# Altium schematic sheet Avalon_ctrlunit.SchDoc
size A1
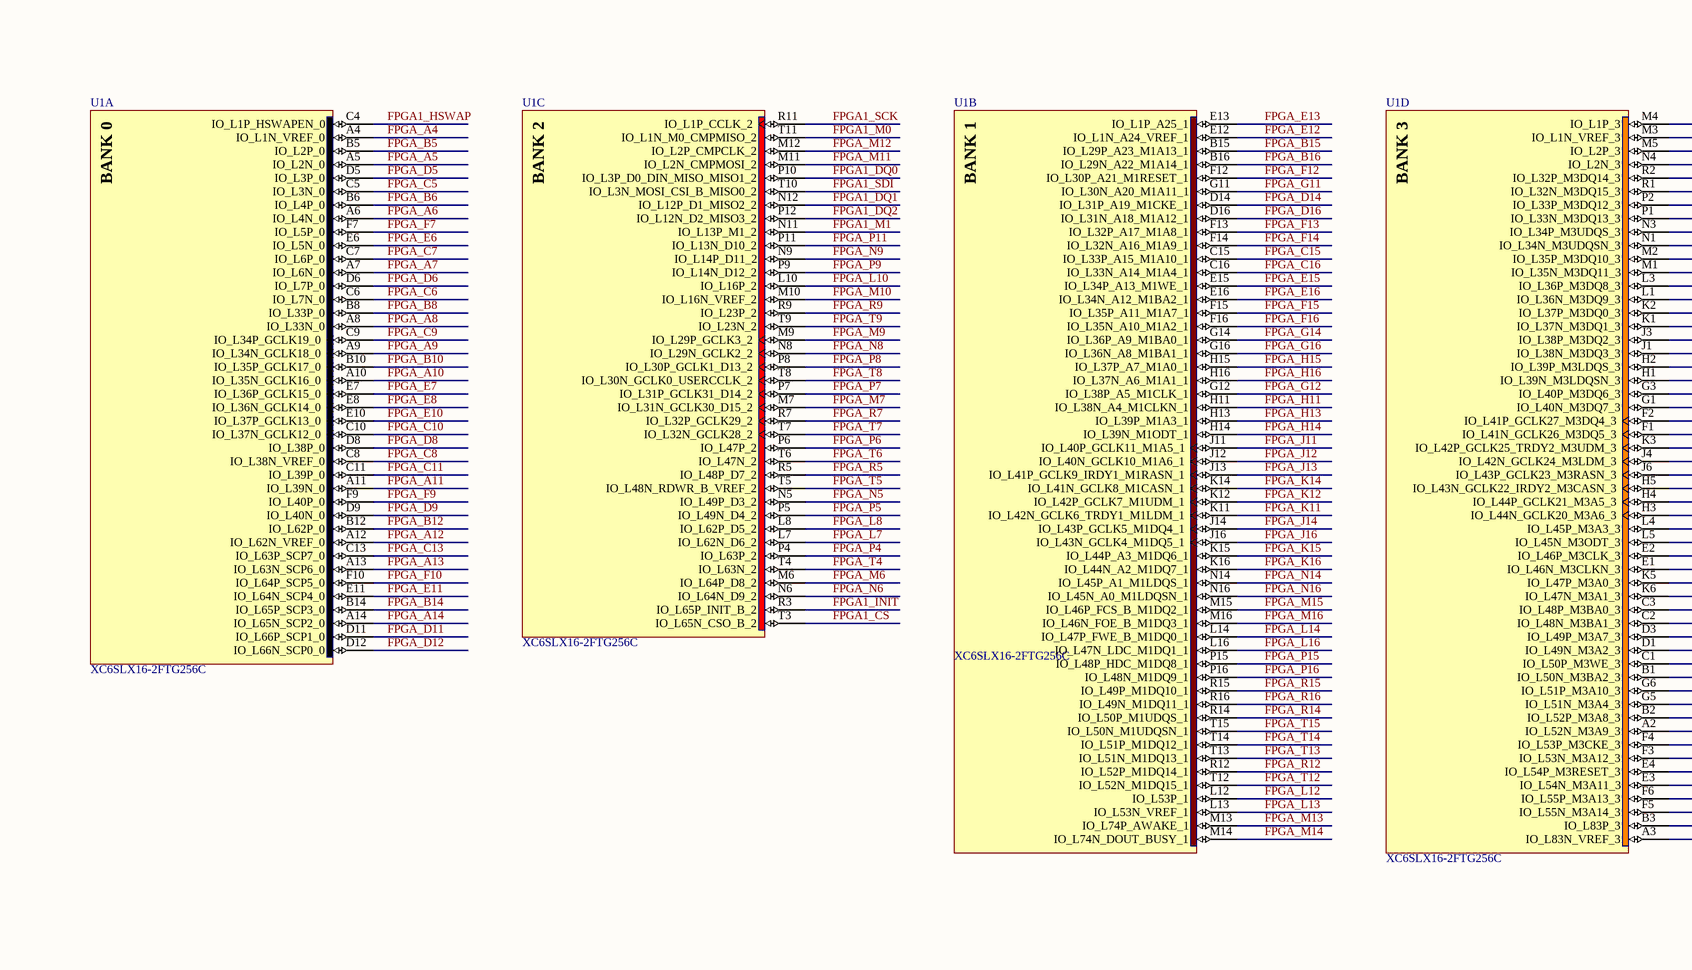
[diagram p0: Avalon_ctrlunit.SchDoc, top left]
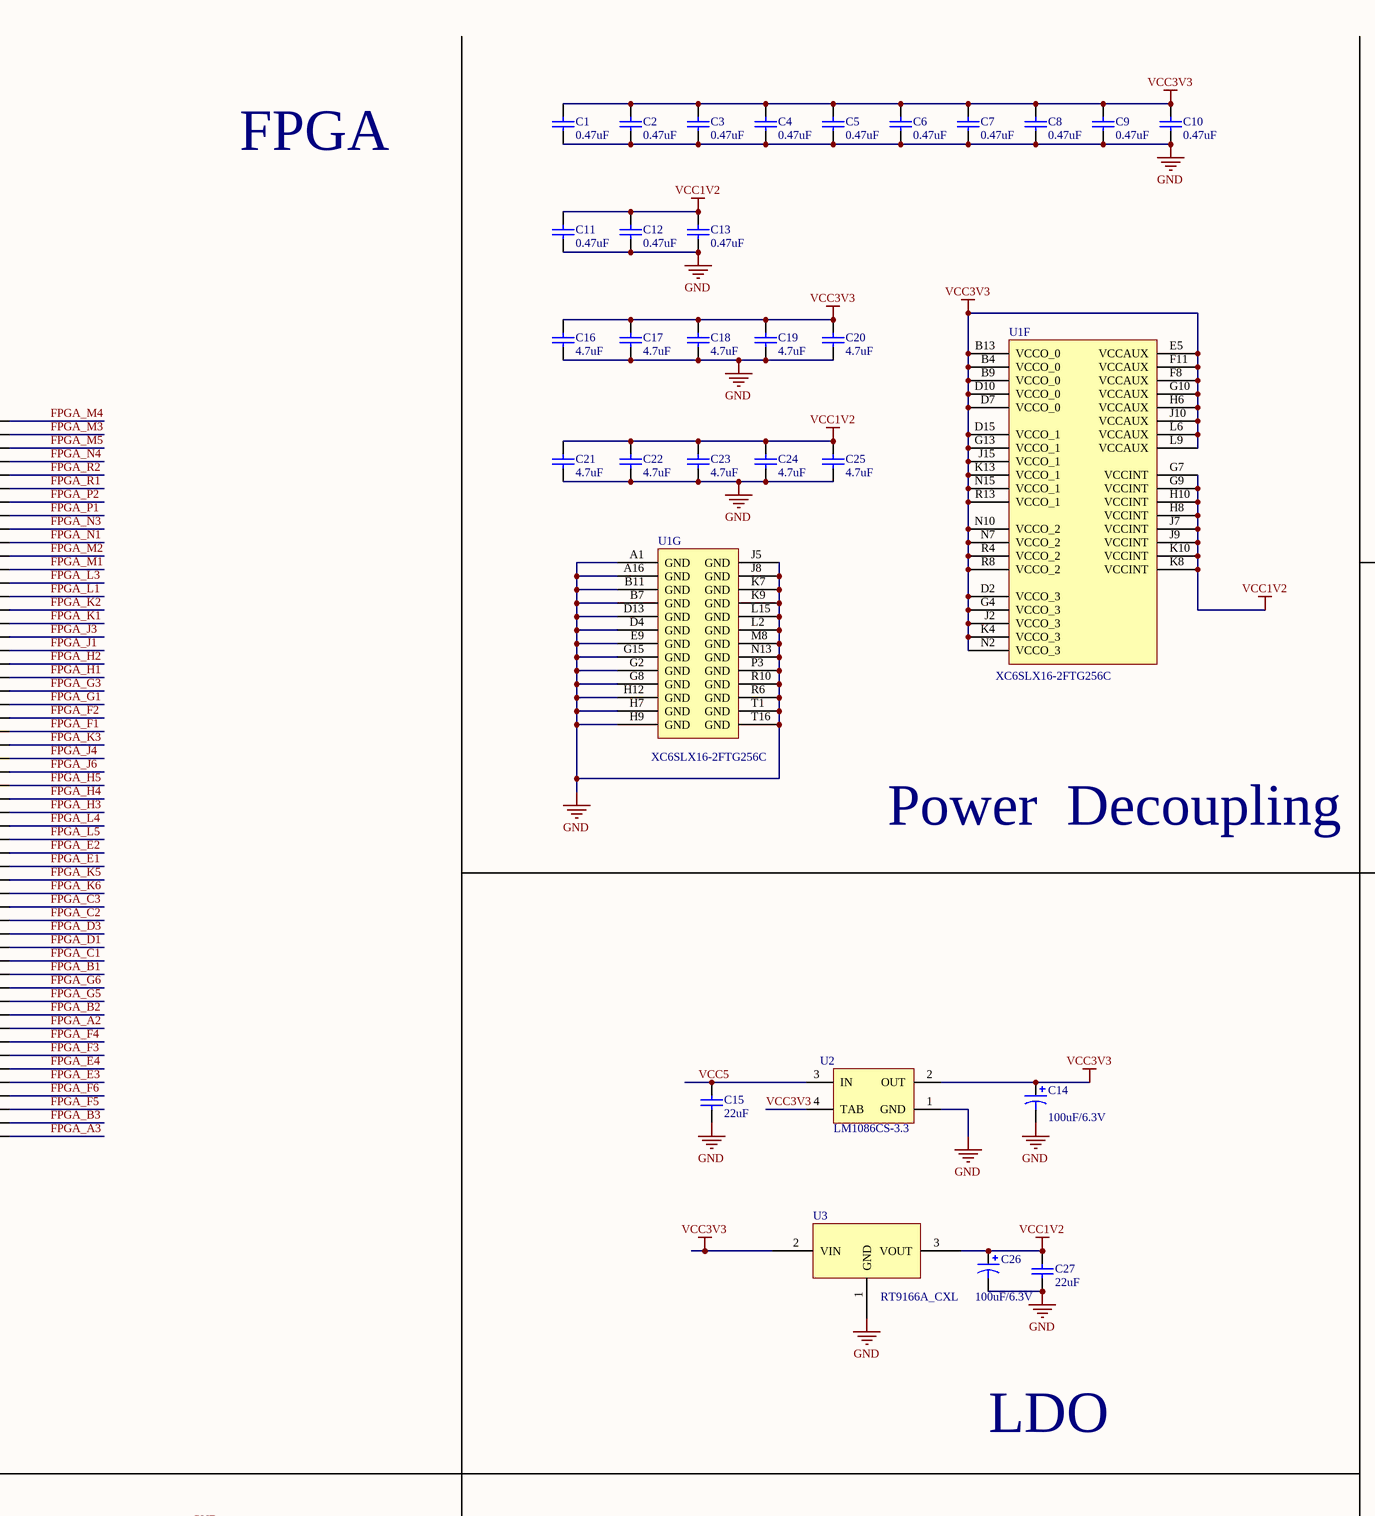
[diagram p1: Avalon_ctrlunit.SchDoc, top middle]
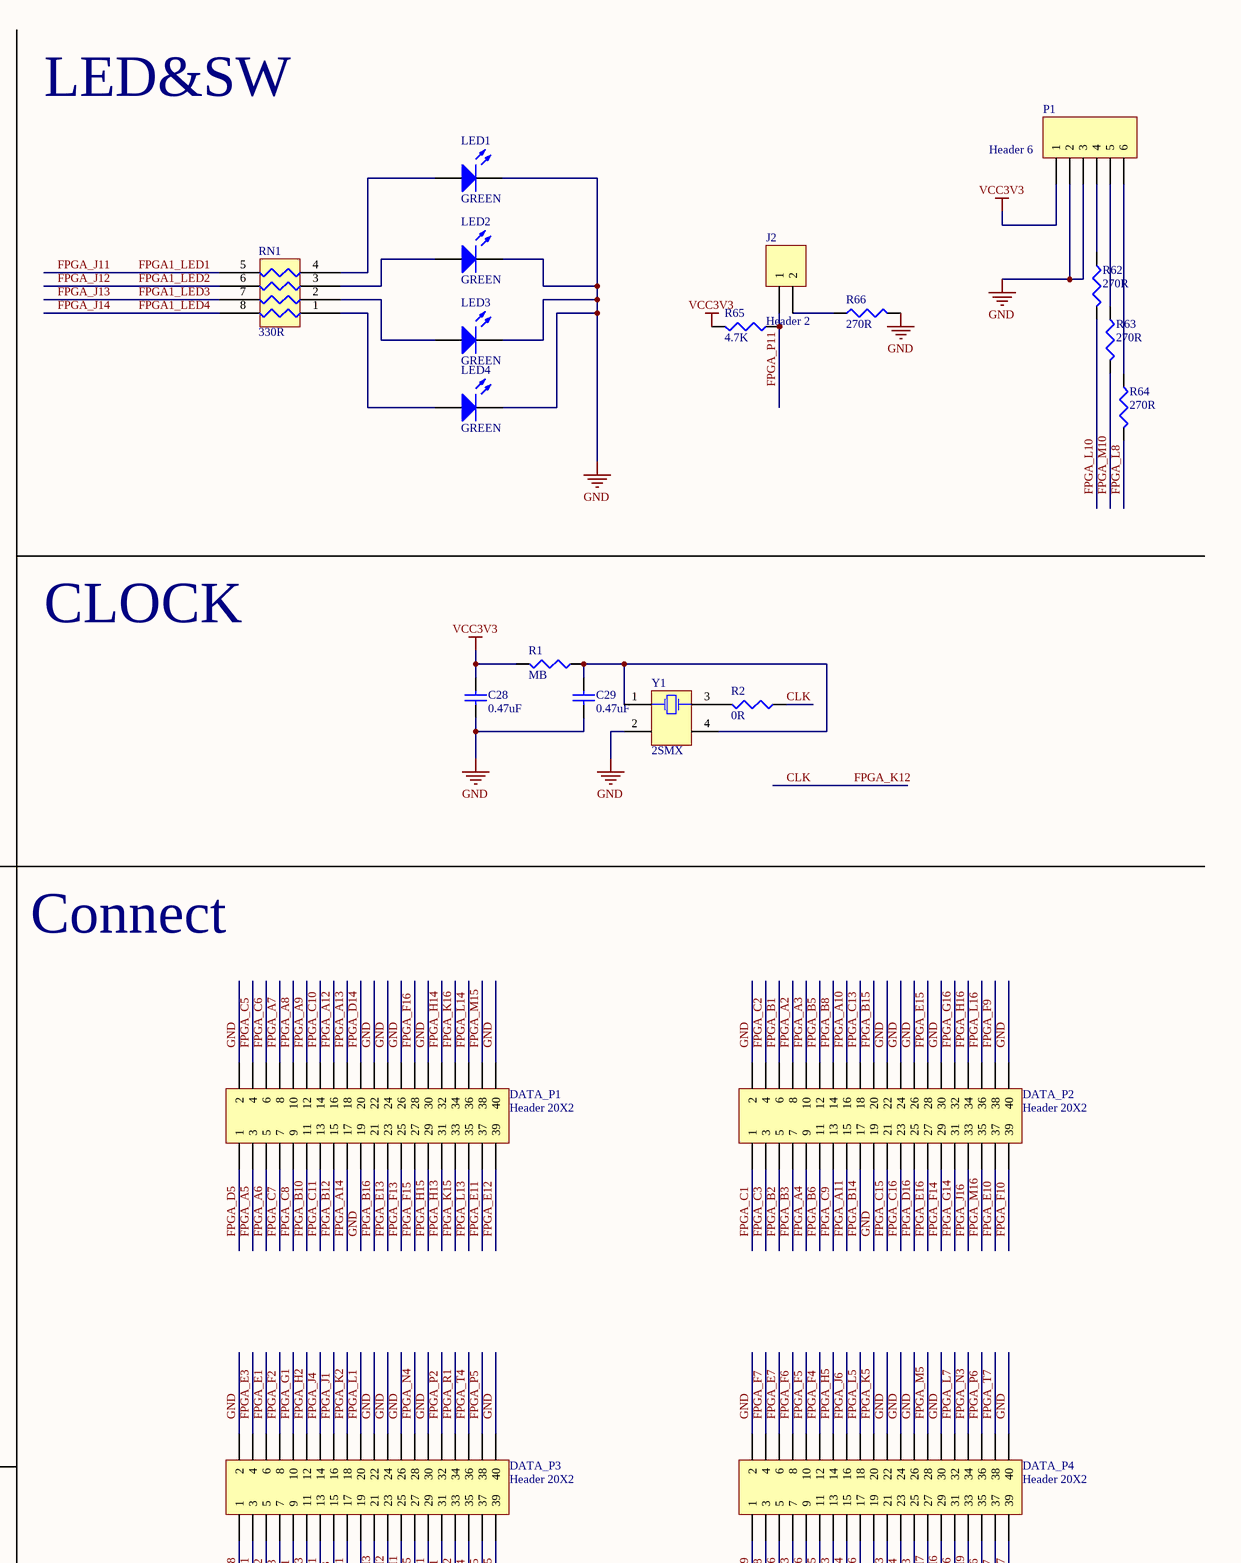
[diagram p2: Avalon_ctrlunit.SchDoc, top right]
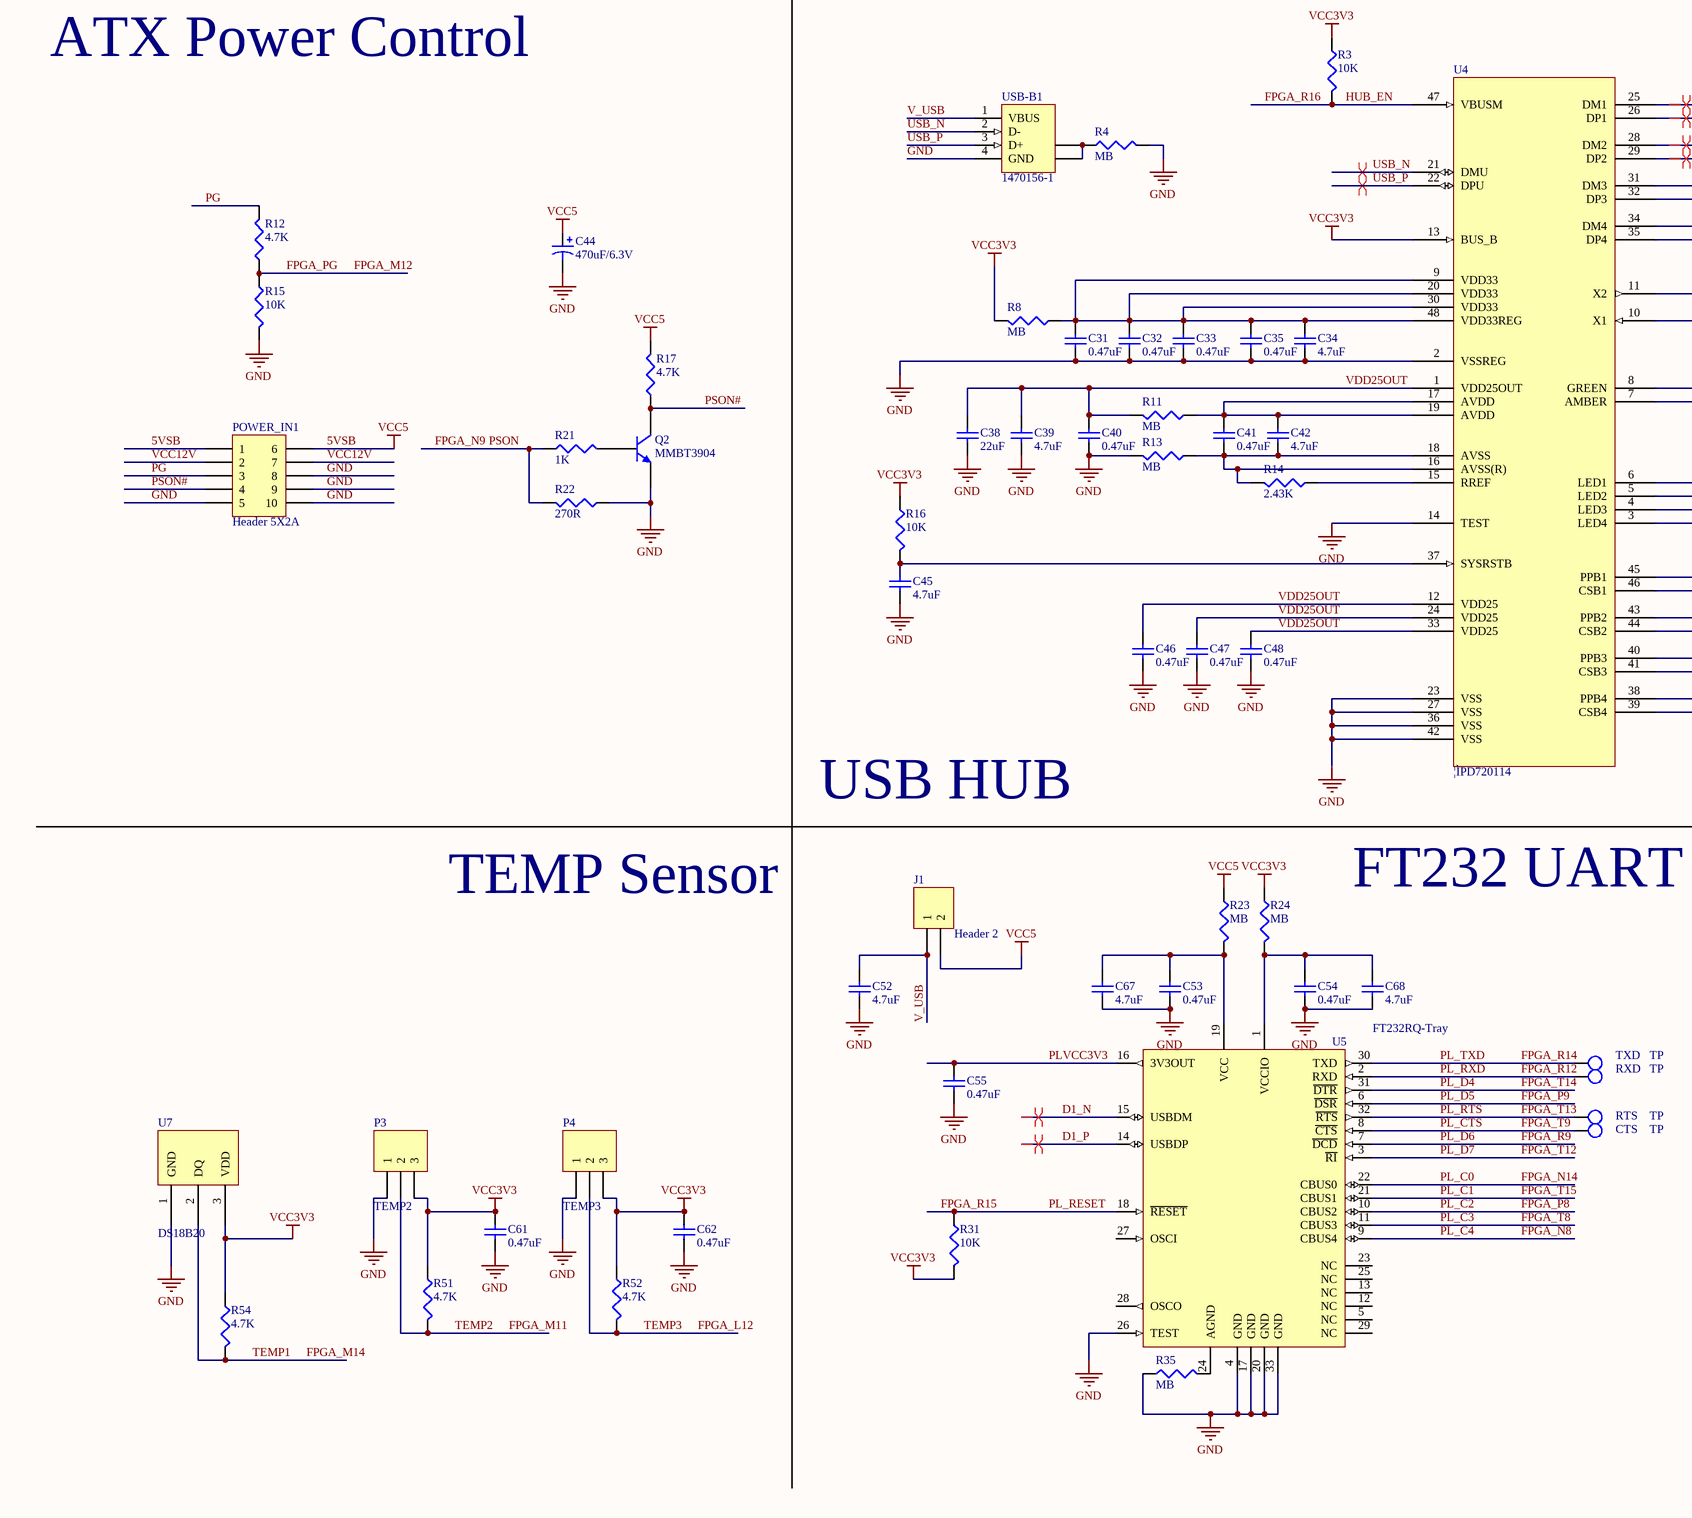
[diagram p3: Avalon_ctrlunit.SchDoc, bottom left]
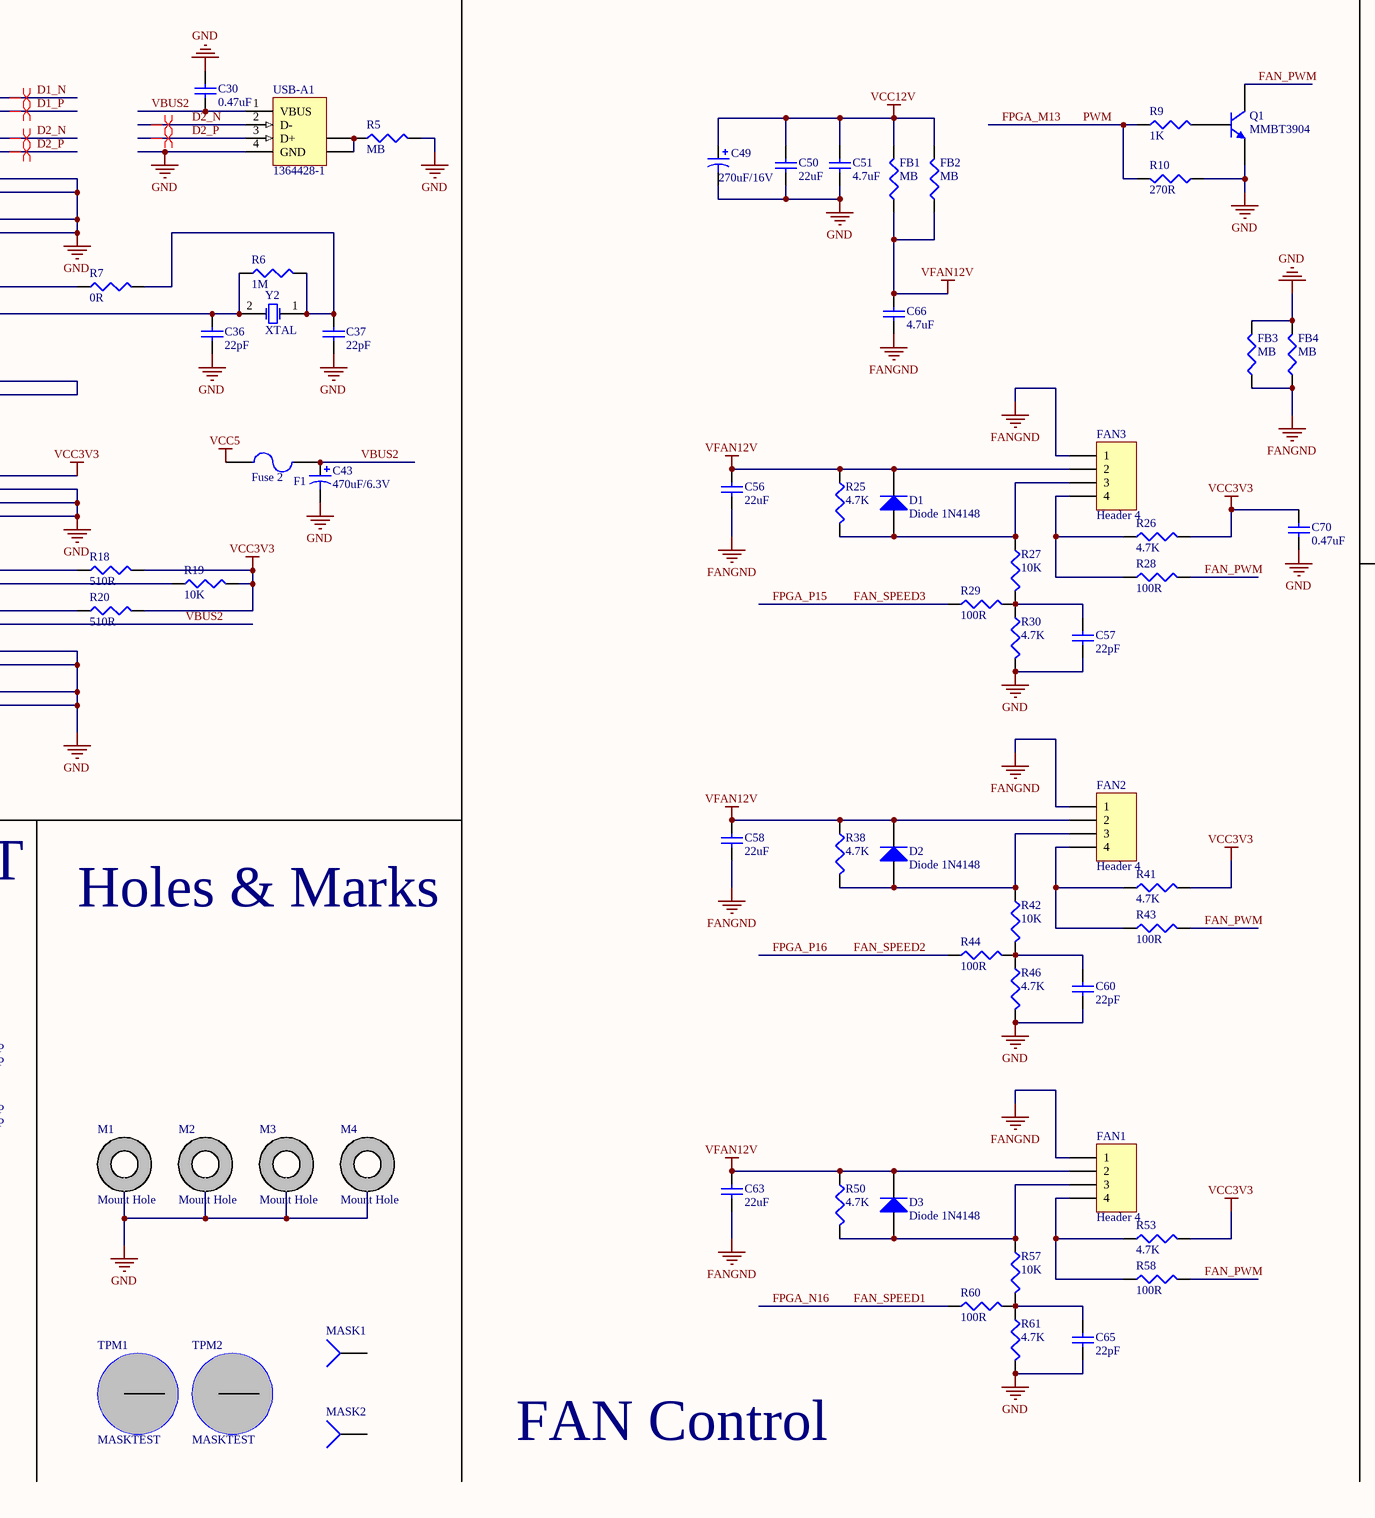
[diagram p4: Avalon_ctrlunit.SchDoc, bottom middle]
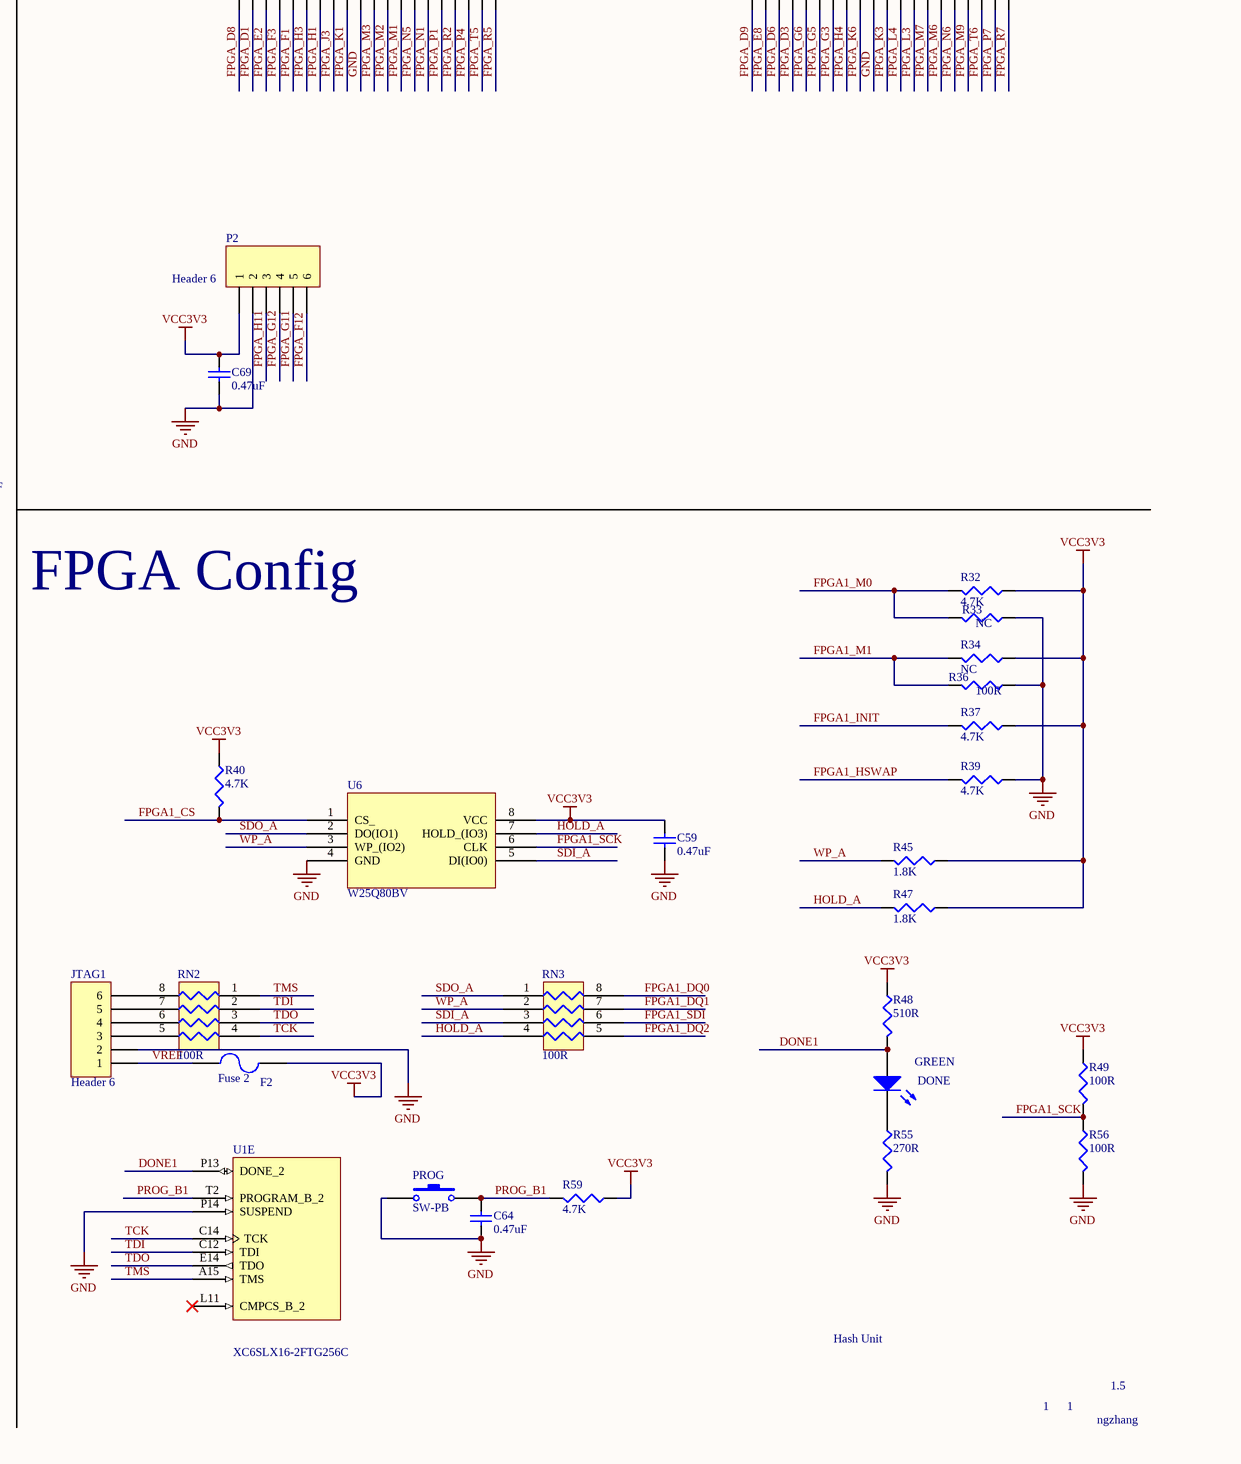
[diagram p5: Avalon_ctrlunit.SchDoc, bottom right]

## Parts
C1  0.47uF  [CAPC1005L]
C2  0.47uF  [CAPC1005L]
C3  0.47uF  [CAPC1005L]
C4  0.47uF  [CAPC1005L]
C5  0.47uF  [CAPC1005L]
C6  0.47uF  [CAPC1005L]
C7  0.47uF  [CAPC1005L]
C8  0.47uF  [CAPC1005L]
C9  0.47uF  [CAPC1005L]
C10  0.47uF  [CAPC1005L]
C11  0.47uF  [CAPC1005L]
C12  0.47uF  [CAPC1005L]
C13  0.47uF  [CAPC1005L]
C14  100uF/6.3V  [C]
C15  22uF  [CAPC3216L]
C16  4.7uF  [CAPC1608L]
C17  4.7uF  [CAPC1608L]
C18  4.7uF  [CAPC1608L]
C19  4.7uF  [CAPC1608L]
C20  4.7uF  [CAPC1608L]
C21  4.7uF  [CAPC1608L]
C22  4.7uF  [CAPC1608L]
C23  4.7uF  [CAPC1608L]
C24  4.7uF  [CAPC1608L]
C25  4.7uF  [CAPC1608L]
C26  100uF/6.3V  [C]
C27  22uF  [CAPC3216L]
C28  0.47uF  [CAPC1005L]
C29  0.47uF  [CAPC1005L]
C30  0.47uF  [CAPC1005L]
C31  0.47uF  [CAPC1005L]
C32  0.47uF  [CAPC1005L]
C33  0.47uF  [CAPC1005L]
C34  4.7uF  [CAPC1608L]
C35  0.47uF  [CAPC1005L]
C36  22pF  [CAPC1005L]
C37  22pF  [CAPC1005L]
C38  22uF  [CAPC3216L]
C39  4.7uF  [CAPC1608L]
C40  0.47uF  [CAPC1005L]
C41  0.47uF  [CAPC1005L]
C42  4.7uF  [CAPC1608L]
C43  470uF/6.3V  [CAP8X8]
C44  470uF/6.3V  [CAP8X8]
C45  4.7uF  [CAPC1608L]
C46  0.47uF  [CAPC1005L]
C47  0.47uF  [CAPC1005L]
C48  0.47uF  [CAPC1005L]
C49  270uF/16V  [CAP8X8]
C50  22uF  [CAPC3225N]
C51  4.7uF  [CAPC1608L]
C52  4.7uF  [CAPC1608L]
C53  0.47uF  [CAPC1005L]
C54  0.47uF  [CAPC1005L]
C55  0.47uF  [CAPC1005L]
C56  22uF  [CAPC3225N]
C57  22pF  [CAPC1005L]
C58  22uF  [CAPC3225N]
C59  0.47uF  [CAPC1005L]
C60  22pF  [CAPC1005L]
C61  0.47uF  [CAPC1005L]
C62  0.47uF  [CAPC1005L]
C63  22uF  [CAPC3225N]
C64  0.47uF  [CAPC1005L]
C65  22pF  [CAPC1005L]
C66  4.7uF  [CAPC1608L]
C67  4.7uF  [CAPC1608L]
C68  4.7uF  [CAPC1608L]
C69  0.47uF  [CAPC1005L]
C70  0.47uF  [CAPC1005L]
CTS  TP  [TP]
D1  Diode 1N4148  [CD3216-1206]
D2  Diode 1N4148  [CD3216-1206]
D3  Diode 1N4148  [CD3216-1206]
DATA_P1  Header 20X2  [IDE40]
DATA_P2  Header 20X2  [IDE40]
DATA_P3  Header 20X2  [IDE40]
DATA_P4  Header 20X2  [IDE40]
DONE  GREEN  [CD1608-0603]
F1  Fuse 2  [RESC3216N]
F2  Fuse 2  [RESC3216N]
FAN1  Header 4  [4PINFAN]
FAN2  Header 4  [4PINFAN]
FAN3  Header 4  [4PINFAN]
FB1  MB  [INDC3216L]
FB2  MB  [INDC3216L]
FB3  MB  [INDC3216L]
FB4  MB  [INDC3216L]
J1  Header 2  [HDR1X2]
J2  Header 2  [HDR1X2]
JTAG1  Header 6  [HDR1X6]
LED1  GREEN  [CD1608-0603]
LED2  GREEN  [CD1608-0603]
LED3  GREEN  [CD1608-0603]
LED4  GREEN  [CD1608-0603]
M1  Mount Hole  [MHOLE2]
M2  Mount Hole  [MHOLE2]
M3  Mount Hole  [MHOLE2]
M4  Mount Hole  [MHOLE2]
MASK1  Socket  [MASK_LT]  (value not drawn)
MASK2  Socket  [MASK_LT]  (value not drawn)
P1  Header 6  [HDR1X6]
P2  Header 6  [HDR1X6]
P3  TEMP2  [3PIN]
P4  TEMP3  [3PIN]
POWER_IN1  Header 5X2A  [PWR_10PIN]
PROG  SW-PB  [SKQMA]
Q1  MMBT3904  [SOT23_L]
Q2  MMBT3904  [SOT23_L]
R1  MB  [RESC1005L]
R2  0R  [RESC1005L]
R3  10K  [RESC1005L]
R4  MB  [RESC1005L]
R5  MB  [RESC1005L]
R6  1M  [RESC1005L]
R7  0R  [RESC1005L]
R8  MB  [RESC1005L]
R9  1K  [RESC1005L]
R10  270R  [RESC1005L]
R11  MB  [RESC1005L]
R12  4.7K  [RESC1005L]
R13  MB  [RESC1005L]
R14  2.43K  [RESC1005L]
R15  10K  [RESC1005L]
R16  10K  [RESC1005L]
R17  4.7K  [RESC1005L]
R18  510R  [RESC1005L]
R19  10K  [RESC1005L]
R20  510R  [RESC1005L]
R21  1K  [RESC1005L]
R22  270R  [RESC1005L]
R23  MB  [RESC1005L]
R24  MB  [RESC1005L]
R25  4.7K  [RESC1005L]
R26  4.7K  [RESC1005L]
R27  10K  [RESC1005L]
R28  100R  [RESC1005L]
R29  100R  [RESC1005L]
R30  4.7K  [RESC1005L]
R31  10K  [RESC1005L]
R32  4.7K  [RESC1005L]
R33  NC  [RESC1005L]
R34  NC  [RESC1005L]
R35  MB  [RESC1005L]
R36  100R  [RESC1005L]
R37  4.7K  [RESC1005L]
R38  4.7K  [RESC1005L]
R39  4.7K  [RESC1005L]
R40  4.7K  [RESC1005L]
R41  4.7K  [RESC1005L]
R42  10K  [RESC1005L]
R43  100R  [RESC1005L]
R44  100R  [RESC1005L]
R45  1.8K  [RESC1005L]
R46  4.7K  [RESC1005L]
R47  1.8K  [RESC1005L]
R48  510R  [RESC1005L]
R49  100R  [RESC1005L]
R50  4.7K  [RESC1005L]
R51  4.7K  [RESC1005L]
R52  4.7K  [RESC1005L]
R53  4.7K  [RESC1005L]
R54  4.7K  [RESC1005L]
R55  270R  [RESC1005L]
R56  100R  [RESC1005L]
R57  10K  [RESC1005L]
R58  100R  [RESC1005L]
R59  4.7K  [RESC1005L]
R60  100R  [RESC1005L]
R61  4.7K  [RESC1005L]
R62  270R  [RESC1005L]
R63  270R  [RESC1005L]
R64  270R  [RESC1005L]
R65  4.7K  [RESC1005L]
R66  270R  [RESC1005L]
RN1  330R  [EXBV8V]
RN2  100R  [EXBV8V]
RN3  100R  [EXBV8V]
RTS  TP  [TP]
RXD  TP  [TP]
TPM1  MASKTEST  [MASKTEST]
TPM2  MASKTEST  [MASKTEST]
TXD  TP  [TP]
U1  XC6SLX16-2FTG256C  [FTG256_L]  (parts A,B,C,D,E,F,G of 7)
U2  LM1086CS-3.3  [TS3B_M]
U3  RT9166A_CXL  [SOT-89_M]
U4  ¦ÌPD720114  [TQFP48_L]
U5  FT232RQ-Tray  [PQFN5X5-32_V_M]
U6  W25Q80BV  [WSOP8]
U7  DS18B20  [TO-92_M]
USB-A1  1364428-1  [1364428]
USB-B1  1470156-1  [1470156]
Y1  2SMX  [SMX2]
Y2  XTAL  [4SMX]

## Nets
5VSB: C15.2 C44.1 F1.1 J1.2 POWER_IN1.1 POWER_IN1.6 R17.2 R23.1 U2.3(IN)  [also labelled VCC5]
FANGND: C56.1 C58.1 C63.1 C66.1 FAN1.1 FAN2.1 FAN3.1 FB3.1 FB4.1
GND: C1.2 C2.2 C3.2 C4.2 C5.2 C6.2 C7.2 C8.2 C9.2 C10.2 C11.2 C12.2 C13.2 C14.2 C15.1 C16.1 C17.1 C18.1 C19.1 C20.1 C21.1 C22.1 C23.1 C24.1 C25.1 C26.2 C27.1 C28.1 C29.1 C30.2 C31.1 C32.1 C33.1 C34.1 C35.1 C36.2 C37.2 C38.1 C39.1 C40.1 C43.2 C44.2 C45.1 C46.1 C47.1 C48.1 C49.2 C50.1 C51.1 C52.2 C53.1 C54.1 C55.1 C57.2 C59.1 C60.2 C61.2 C62.2 C64.2 C65.2 C67.1 C68.1 C69.2 C70.1 DATA_P1.2 DATA_P1.19 DATA_P1.22 DATA_P1.24 DATA_P1.26 DATA_P1.30 DATA_P1.40 DATA_P2.2 DATA_P2.19 DATA_P2.22 DATA_P2.24 DATA_P2.26 DATA_P2.30 DATA_P2.40 DATA_P3.2 DATA_P3.19 DATA_P3.22 DATA_P3.24 DATA_P3.26 DATA_P3.30 DATA_P3.40 DATA_P4.2 DATA_P4.19 DATA_P4.22 DATA_P4.24 DATA_P4.26 DATA_P4.30 DATA_P4.40 FB3.2 FB4.2 JTAG1.2 LED1.2(K) LED2.2(K) LED3.2(K) LED4.2(K) M1.0(PIN) M2.0(PIN) M3.0(PIN) M4.0(PIN) P1.2 P1.3 P2.2 P3.1 P4.1 POWER_IN1.5 POWER_IN1.8 POWER_IN1.9 POWER_IN1.10 PROG.1 Q1.2(E) Q2.2(E) R4.2 R5.2 R10.1 R13.2 R15.2 R22.1 R30.2 R33.1 R35.1 R36.1 R39.1 R46.2 R55.2 R56.2 R61.2 R66.2 U1.A1(GND) U1.A16(GND) U1.B7(GND) U1.B11(GND) U1.D4(GND) U1.D13(GND) U1.E9(GND) U1.G2(GND) U1.G8(GND) U1.G15(GND) U1.H7(GND) U1.H9(GND) U1.H12(GND) U1.J5(GND) U1.J8(GND) U1.K7(GND) U1.K9(GND) U1.L2(GND) U1.L15(GND) U1.M8(GND) U1.N13(GND) U1.P3(GND) U1.P14(SUSPEND) U1.R6(GND) U1.R10(GND) U1.T1(GND) U1.T16(GND) U2.1(GND) U3.1(GND) U4.2(VSSREG) U4.3(LED4) U4.4(LED3) U4.5(LED2) U4.14(TEST) U4.23(VSS) U4.27(VSS) U4.31(DM3) U4.32(DP3) U4.34(DM4) U4.35(DP4) U4.36(VSS) U4.38(PPB4) U4.39(CSB4) U4.40(PPB3) U4.41(CSB3) U4.42(VSS) U5.4(GND) U5.17(GND) U5.20(GND) U5.26(TEST) U5.33(GND) U6.4(GND) U7.1(GND) USB-A1.4(GND) USB-B1.4(GND) Y1.2(NC)
VCC1V2: C11.1 C12.1 C13.1 C21.2 C22.2 C23.2 C24.2 C25.2 C26.1 C27.2 U1.G7(VCCINT) U1.G9(VCCINT) U1.H8(VCCINT) U1.H10(VCCINT) U1.J7(VCCINT) U1.J9(VCCINT) U1.K8(VCCINT) U1.K10(VCCINT) U3.3(VOUT)
VCC3V3: C1.1 C2.1 C3.1 C4.1 C5.1 C6.1 C7.1 C8.1 C9.1 C10.1 C14.1 C16.2 C17.2 C18.2 C19.2 C20.2 C28.2 C59.2 C61.1 C62.1 C69.1 C70.2 F2.2 P1.1 P2.1 P3.3 P4.3 R1.2 R3.1 R8.2 R16.1 R18.2 R19.2 R20.2 R24.1 R26.2 R31.2 R32.1 R34.1 R37.1 R40.1 R41.2 R45.1 R47.1 R48.1 R49.1 R51.1 R52.1 R53.2 R54.1 R59.1 R65.2 U1.B4(VCCO_0) U1.B9(VCCO_0) U1.B13(VCCO_0) U1.D2(VCCO_3) U1.D7(VCCO_0) U1.D10(VCCO_0) U1.D15(VCCO_1) U1.E5(VCCAUX) U1.F8(VCCAUX) U1.F11(VCCAUX) U1.G4(VCCO_3) U1.G10(VCCAUX) U1.G13(VCCO_1) U1.H6(VCCAUX) U1.J2(VCCO_3) U1.J10(VCCAUX) U1.J15(VCCO_1) U1.K4(VCCO_3) U1.K13(VCCO_1) U1.L6(VCCAUX) U1.L9(VCCAUX) U1.N2(VCCO_3) U1.N7(VCCO_2) U1.N10(VCCO_2) U1.N15(VCCO_1) U1.R4(VCCO_2) U1.R8(VCCO_2) U1.R13(VCCO_1) U2.2(OUT) U2.4(TAB) U3.2(VIN) U4.6(LED1) U4.13(BUS_B) U6.8(VCC) U7.3(VDD)
VCC12V: C49.1 C50.2 C51.2 FB1.2 FB2.2 POWER_IN1.2 POWER_IN1.7
VFAN12V: C56.2 C58.2 C63.2 C66.2 D1.2(K) D2.2(K) D3.2(K) FAN1.2 FAN2.2 FAN3.2 FB1.1 FB2.1 R25.1 R38.1 R50.1
CLK: R2.1 U1.K12(IO_L42P_GCLK7_M1UDM_1)  [also labelled FPGA_K12]
D1_N: U4.25(DM1) U5.15(USBDM)
D1_P: U4.26(DP1) U5.14(USBDP)
D2_N: U4.28(DM2) USB-A1.2(D-)
D2_P: U4.29(DP2) USB-A1.3(D+)
DONE1: DONE.1(A) R48.2 U1.P13(DONE_2)
FAN_PWM: Q1.3(C) R28.2 R43.2 R58.2
FAN_SPEED1: R60.1 U1.N16(IO_L45N_A0_M1LDQSN_1)  [also labelled FPGA_N16]
FAN_SPEED2: R44.1 U1.P16(IO_L48N_M1DQ9_1)  [also labelled FPGA_P16]
FAN_SPEED3: R29.1 U1.P15(IO_L48P_HDC_M1DQ8_1)  [also labelled FPGA_P15]
FPGA1_CS: R40.2 U1.T3(IO_L65N_CSO_B_2) U6.1(CS_)
FPGA1_DQ0: RN3.8 U1.P10(IO_L3P_D0_DIN_MISO_MISO1_2)
FPGA1_DQ1: RN3.7 U1.N12(IO_L12P_D1_MISO2_2)
FPGA1_DQ2: RN3.5 U1.P12(IO_L12N_D2_MISO3_2)
FPGA1_HSWAP: R39.2 U1.C4(IO_L1P_HSWAPEN_0)
FPGA1_INIT: R37.2 U1.R3(IO_L65P_INIT_B_2)
FPGA1_LED1: RN1.5 U1.J11(IO_L40P_GCLK11_M1A5_1)  [also labelled FPGA_J11]
FPGA1_LED2: RN1.6 U1.J12(IO_L40N_GCLK10_M1A6_1)  [also labelled FPGA_J12]
FPGA1_LED3: RN1.7 U1.J13(IO_L41P_GCLK9_IRDY1_M1RASN_1)  [also labelled FPGA_J13]
FPGA1_LED4: RN1.8 U1.J14(IO_L43P_GCLK5_M1DQ4_1)  [also labelled FPGA_J14]
FPGA1_M0: R32.2 R33.2 U1.T11(IO_L1N_M0_CMPMISO_2)
FPGA1_M1: R34.2 R36.2 U1.N11(IO_L13P_M1_2)
FPGA1_SCK: R49.2 R56.1 U1.R11(IO_L1P_CCLK_2) U6.6(CLK)
FPGA1_SDI: RN3.6 U1.T10(IO_L3N_MOSI_CSI_B_MISO0_2)
FPGA_A2: DATA_P2.8 U1.A2(IO_L52N_M3A9_3)
FPGA_A3: DATA_P2.10 U1.A3(IO_L83N_VREF_3)
FPGA_A4: DATA_P2.9 U1.A4(IO_L1N_VREF_0)
FPGA_A5: DATA_P1.3 U1.A5(IO_L2N_0)
FPGA_A6: DATA_P1.5 U1.A6(IO_L4N_0)
FPGA_A7: DATA_P1.8 U1.A7(IO_L6N_0)
FPGA_A8: DATA_P1.10 U1.A8(IO_L33N_0)
FPGA_A9: DATA_P1.12 U1.A9(IO_L34N_GCLK18_0)
FPGA_A10: DATA_P2.16 U1.A10(IO_L35N_GCLK16_0)
FPGA_A11: DATA_P2.15 U1.A11(IO_L39N_0)
FPGA_A12: DATA_P1.16 U1.A12(IO_L62N_VREF_0)
FPGA_A13: DATA_P1.18 U1.A13(IO_L63N_SCP6_0)
FPGA_A14: DATA_P1.17 U1.A14(IO_L65N_SCP2_0)
FPGA_B1: DATA_P2.6 U1.B1(IO_L50N_M3BA2_3)
FPGA_B2: DATA_P2.5 U1.B2(IO_L52P_M3A8_3)
FPGA_B3: DATA_P2.7 U1.B3(IO_L83P_3)
FPGA_B5: DATA_P2.12 U1.B5(IO_L2P_0)
FPGA_B6: DATA_P2.11 U1.B6(IO_L4P_0)
FPGA_B8: DATA_P2.14 U1.B8(IO_L33P_0)
FPGA_B10: DATA_P1.11 U1.B10(IO_L35P_GCLK17_0)
FPGA_B12: DATA_P1.15 U1.B12(IO_L62P_0)
FPGA_B14: DATA_P2.17 U1.B14(IO_L65P_SCP3_0)
FPGA_B15: DATA_P2.20 U1.B15(IO_L29P_A23_M1A13_1)
FPGA_B16: DATA_P1.21 U1.B16(IO_L29N_A22_M1A14_1)
FPGA_C1: DATA_P2.1 U1.C1(IO_L50P_M3WE_3)
FPGA_C2: DATA_P2.4 U1.C2(IO_L48N_M3BA1_3)
FPGA_C3: DATA_P2.3 U1.C3(IO_L48P_M3BA0_3)
FPGA_C5: DATA_P1.4 U1.C5(IO_L3N_0)
FPGA_C6: DATA_P1.6 U1.C6(IO_L7N_0)
FPGA_C7: DATA_P1.7 U1.C7(IO_L6P_0)
FPGA_C8: DATA_P1.9 U1.C8(IO_L38N_VREF_0)
FPGA_C9: DATA_P2.13 U1.C9(IO_L34P_GCLK19_0)
FPGA_C10: DATA_P1.14 U1.C10(IO_L37N_GCLK12_0)
FPGA_C11: DATA_P1.13 U1.C11(IO_L39P_0)
FPGA_C13: DATA_P2.18 U1.C13(IO_L63P_SCP7_0)
FPGA_C15: DATA_P2.21 U1.C15(IO_L33P_A15_M1A10_1)
FPGA_C16: DATA_P2.23 U1.C16(IO_L33N_A14_M1A4_1)
FPGA_D1: DATA_P3.3 U1.D1(IO_L49N_M3A2_3)
FPGA_D3: DATA_P4.7 U1.D3(IO_L49P_M3A7_3)
FPGA_D5: DATA_P1.1 U1.D5(IO_L3P_0)
FPGA_D6: DATA_P4.5 U1.D6(IO_L7P_0)
FPGA_D8: DATA_P3.1 U1.D8(IO_L38P_0)
FPGA_D9: DATA_P4.1 U1.D9(IO_L40N_0)
FPGA_D11: U1.D11(IO_L66P_SCP1_0)
FPGA_D12: U1.D12(IO_L66N_SCP0_0)
FPGA_D14: DATA_P1.20 U1.D14(IO_L31P_A19_M1CKE_1)
FPGA_D16: DATA_P2.25 U1.D16(IO_L31N_A18_M1A12_1)
FPGA_E1: DATA_P3.6 U1.E1(IO_L46N_M3CLKN_3)
FPGA_E2: DATA_P3.5 U1.E2(IO_L46P_M3CLK_3)
FPGA_E3: DATA_P3.4 U1.E3(IO_L54N_M3A11_3)
FPGA_E4: U1.E4(IO_L54P_M3RESET_3)
FPGA_E6: U1.E6(IO_L5N_0)
FPGA_E7: DATA_P4.6 U1.E7(IO_L36P_GCLK15_0)
FPGA_E8: DATA_P4.3 U1.E8(IO_L36N_GCLK14_0)
FPGA_E10: DATA_P2.37 U1.E10(IO_L37P_GCLK13_0)
FPGA_E11: DATA_P1.37 U1.E11(IO_L64N_SCP4_0)
FPGA_E12: DATA_P1.39 U1.E12(IO_L1N_A24_VREF_1)
FPGA_E13: DATA_P1.23 U1.E13(IO_L1P_A25_1)
FPGA_E15: DATA_P2.28 U1.E15(IO_L34P_A13_M1WE_1)
FPGA_E16: DATA_P2.27 U1.E16(IO_L34N_A12_M1BA2_1)
FPGA_F1: DATA_P3.9 U1.F1(IO_L41N_GCLK26_M3DQ5_3)
FPGA_F2: DATA_P3.8 U1.F2(IO_L41P_GCLK27_M3DQ4_3)
FPGA_F3: DATA_P3.7 U1.F3(IO_L53N_M3A12_3)
FPGA_F4: DATA_P4.12 U1.F4(IO_L53P_M3CKE_3)
FPGA_F5: DATA_P4.10 U1.F5(IO_L55N_M3A14_3)
FPGA_F6: DATA_P4.8 U1.F6(IO_L55P_M3A13_3)
FPGA_F7: DATA_P4.4 U1.F7(IO_L5P_0)
FPGA_F9: DATA_P2.38 U1.F9(IO_L40P_0)
FPGA_F10: DATA_P2.39 U1.F10(IO_L64P_SCP5_0)
FPGA_F12: P2.6 U1.F12(IO_L30P_A21_M1RESET_1)
FPGA_F13: DATA_P1.25 U1.F13(IO_L32P_A17_M1A8_1)
FPGA_F14: DATA_P2.29 U1.F14(IO_L32N_A16_M1A9_1)
FPGA_F15: DATA_P1.27 U1.F15(IO_L35P_A11_M1A7_1)
FPGA_F16: DATA_P1.28 U1.F16(IO_L35N_A10_M1A2_1)
FPGA_G1: DATA_P3.10 U1.G1(IO_L40N_M3DQ7_3)
FPGA_G3: DATA_P4.13 U1.G3(IO_L40P_M3DQ6_3)
FPGA_G5: DATA_P4.11 U1.G5(IO_L51N_M3A4_3)
FPGA_G6: DATA_P4.9 U1.G6(IO_L51P_M3A10_3)
FPGA_G11: P2.5 U1.G11(IO_L30N_A20_M1A11_1)
FPGA_G12: P2.4 U1.G12(IO_L38P_A5_M1CLK_1)
FPGA_G14: DATA_P2.31 U1.G14(IO_L36P_A9_M1BA0_1)
FPGA_G16: DATA_P2.32 U1.G16(IO_L36N_A8_M1BA1_1)
FPGA_H1: DATA_P3.13 U1.H1(IO_L39N_M3LDQSN_3)
FPGA_H2: DATA_P3.12 U1.H2(IO_L39P_M3LDQS_3)
FPGA_H3: DATA_P3.11 U1.H3(IO_L44N_GCLK20_M3A6_3)
FPGA_H4: DATA_P4.15 U1.H4(IO_L44P_GCLK21_M3A5_3)
FPGA_H5: DATA_P4.14 U1.H5(IO_L43N_GCLK22_IRDY2_M3CASN_3)
FPGA_H11: P2.3 U1.H11(IO_L38N_A4_M1CLKN_1)
FPGA_H13: DATA_P1.31 U1.H13(IO_L39P_M1A3_1)
FPGA_H14: DATA_P1.32 U1.H14(IO_L39N_M1ODT_1)
FPGA_H15: DATA_P1.29 U1.H15(IO_L37P_A7_M1A0_1)
FPGA_H16: DATA_P2.34 U1.H16(IO_L37N_A6_M1A1_1)
FPGA_J1: DATA_P3.16 U1.J1(IO_L38N_M3DQ3_3)
FPGA_J3: DATA_P3.15 U1.J3(IO_L38P_M3DQ2_3)
FPGA_J4: DATA_P3.14 U1.J4(IO_L42N_GCLK24_M3LDM_3)
FPGA_J6: DATA_P4.16 U1.J6(IO_L43P_GCLK23_M3RASN_3)
FPGA_J16: DATA_P2.33 U1.J16(IO_L43N_GCLK4_M1DQ5_1)
FPGA_K1: DATA_P3.17 U1.K1(IO_L37N_M3DQ1_3)
FPGA_K2: DATA_P3.18 U1.K2(IO_L37P_M3DQ0_3)
FPGA_K3: DATA_P4.21 U1.K3(IO_L42P_GCLK25_TRDY2_M3UDM_3)
FPGA_K5: DATA_P4.20 U1.K5(IO_L47P_M3A0_3)
FPGA_K6: DATA_P4.17 U1.K6(IO_L47N_M3A1_3)
FPGA_K11: U1.K11(IO_L42N_GCLK6_TRDY1_M1LDM_1)
FPGA_K14: U1.K14(IO_L41N_GCLK8_M1CASN_1)
FPGA_K15: DATA_P1.33 U1.K15(IO_L44P_A3_M1DQ6_1)
FPGA_K16: DATA_P1.34 U1.K16(IO_L44N_A2_M1DQ7_1)
FPGA_L1: DATA_P3.20 U1.L1(IO_L36N_M3DQ9_3)
FPGA_L3: DATA_P4.25 U1.L3(IO_L36P_M3DQ8_3)
FPGA_L4: DATA_P4.23 U1.L4(IO_L45P_M3A3_3)
FPGA_L5: DATA_P4.18 U1.L5(IO_L45N_M3ODT_3)
FPGA_L7: DATA_P4.32 U1.L7(IO_L62N_D6_2)
FPGA_L8: R64.2 U1.L8(IO_L62P_D5_2)
FPGA_L10: R62.2 U1.L10(IO_L16P_2)
FPGA_L12: P4.2 R52.2 U1.L12(IO_L53P_1)  [also labelled TEMP3]
FPGA_L13: DATA_P1.35 U1.L13(IO_L53N_VREF_1)
FPGA_L14: DATA_P1.36 U1.L14(IO_L47P_FWE_B_M1DQ0_1)
FPGA_L16: DATA_P2.36 U1.L16(IO_L47N_LDC_M1DQ1_1)
FPGA_M1: DATA_P3.25 U1.M1(IO_L35N_M3DQ11_3)
FPGA_M2: DATA_P3.23 U1.M2(IO_L35P_M3DQ10_3)
FPGA_M3: DATA_P3.21 U1.M3(IO_L1N_VREF_3)
FPGA_M4: U1.M4(IO_L1P_3)
FPGA_M5: DATA_P4.28 U1.M5(IO_L2P_3)
FPGA_M6: DATA_P4.29 U1.M6(IO_L64P_D8_2)
FPGA_M7: DATA_P4.27 U1.M7(IO_L31N_GCLK30_D15_2)
FPGA_M9: DATA_P4.33 U1.M9(IO_L29P_GCLK3_2)
FPGA_M10: R63.2 U1.M10(IO_L16N_VREF_2)
FPGA_M11: P3.2 R51.2 U1.M11(IO_L2N_CMPMOSI_2)  [also labelled TEMP2]
FPGA_M12: R12.1 R15.1 U1.M12(IO_L2P_CMPCLK_2)  [also labelled FPGA_PG]
FPGA_M13: R9.1 R10.2 U1.M13(IO_L74P_AWAKE_1)  [also labelled PWM]
FPGA_M14: R54.2 U1.M14(IO_L74N_DOUT_BUSY_1) U7.2(DQ)  [also labelled TEMP1]
FPGA_M15: DATA_P1.38 U1.M15(IO_L46P_FCS_B_M1DQ2_1)
FPGA_M16: DATA_P2.35 U1.M16(IO_L46N_FOE_B_M1DQ3_1)
FPGA_N1: DATA_P3.29 U1.N1(IO_L34N_M3UDQSN_3)
FPGA_N3: DATA_P4.34 U1.N3(IO_L34P_M3UDQS_3)
FPGA_N4: DATA_P3.28 U1.N4(IO_L2N_3)
FPGA_N5: DATA_P3.27 U1.N5(IO_L49P_D3_2)
FPGA_N6: DATA_P4.31 U1.N6(IO_L64N_D9_2)
FPGA_N8: U1.N8(IO_L29N_GCLK2_2) U5.9(CBUS4)  [also labelled PL_C4]
FPGA_N9: R21.1 R22.2 U1.N9(IO_L14P_D11_2)  [also labelled PSON]
FPGA_N14: U1.N14(IO_L45P_A1_M1LDQS_1) U5.22(CBUS0)  [also labelled PL_C0]
FPGA_P1: DATA_P3.31 U1.P1(IO_L33N_M3DQ13_3)
FPGA_P2: DATA_P3.32 U1.P2(IO_L33P_M3DQ12_3)
FPGA_P4: DATA_P3.35 U1.P4(IO_L63P_2)
FPGA_P5: DATA_P3.38 U1.P5(IO_L49N_D4_2)
FPGA_P6: DATA_P4.36 U1.P6(IO_L47P_2)
FPGA_P7: DATA_P4.37 U1.P7(IO_L31P_GCLK31_D14_2)
FPGA_P8: U1.P8(IO_L30P_GCLK1_D13_2) U5.10(CBUS2)  [also labelled PL_C2]
FPGA_P9: U1.P9(IO_L14N_D12_2) U5.6(~{DSR})  [also labelled PL_D5]
FPGA_P11: J2.1 R65.1 U1.P11(IO_L13N_D10_2)
FPGA_R1: DATA_P3.34 U1.R1(IO_L32N_M3DQ15_3)
FPGA_R2: DATA_P3.33 U1.R2(IO_L32P_M3DQ14_3)
FPGA_R5: DATA_P3.39 U1.R5(IO_L48P_D7_2)
FPGA_R7: DATA_P4.39 U1.R7(IO_L32P_GCLK29_2)
FPGA_R9: U1.R9(IO_L23P_2) U5.7(~{DCD})  [also labelled PL_D6]
FPGA_R12: RXD.1(TP) U1.R12(IO_L52P_M1DQ14_1) U5.2(RXD)  [also labelled PL_RXD]
FPGA_R14: TXD.1(TP) U1.R14(IO_L50P_M1UDQS_1) U5.30(TXD)  [also labelled PL_TXD]
FPGA_R15: R31.1 U1.R15(IO_L49P_M1DQ10_1) U5.18(~{RESET})  [also labelled PL_RESET]
FPGA_R16: R3.2 U1.R16(IO_L49N_M1DQ11_1) U4.47(VBUSM)  [also labelled HUB_EN]
FPGA_T4: DATA_P3.36 U1.T4(IO_L63N_2)
FPGA_T5: DATA_P3.37 U1.T5(IO_L48N_RDWR_B_VREF_2)
FPGA_T6: DATA_P4.35 U1.T6(IO_L47N_2)
FPGA_T7: DATA_P4.38 U1.T7(IO_L32N_GCLK28_2)
FPGA_T8: U1.T8(IO_L30N_GCLK0_USERCCLK_2) U5.11(CBUS3)  [also labelled PL_C3]
FPGA_T9: CTS.1(TP) U1.T9(IO_L23N_2) U5.8(~{CTS})  [also labelled PL_CTS]
FPGA_T12: U1.T12(IO_L52N_M1DQ15_1) U5.3(~{RI})  [also labelled PL_D7]
FPGA_T13: RTS.1(TP) U1.T13(IO_L51N_M1DQ13_1) U5.32(~{RTS})  [also labelled PL_RTS]
FPGA_T14: U1.T14(IO_L51P_M1DQ12_1) U5.31(~{DTR})  [also labelled PL_D4]
FPGA_T15: U1.T15(IO_L50N_M1UDQSN_1) U5.21(CBUS1)  [also labelled PL_C1]
HOLD_A: R47.2 RN3.4 U6.7(HOLD_(IO3))
PG: POWER_IN1.3 R12.2
PLVCC3V3: C55.2 U5.16(3V3OUT)
PROG_B1: C64.1 PROG.2 R59.2 U1.T2(PROGRAM_B_2)
PSON#: POWER_IN1.4 Q2.3(C) R17.1
SDI_A: RN3.3 U6.5(DI(IO0))
SDO_A: RN3.1 U6.2(DO(IO1))
TCK: RN2.4 U1.C14(TCK)
TDI: RN2.2 U1.C12(TDI)
TDO: RN2.3 U1.E14(TDO)
TMS: RN2.1 U1.A15(TMS)
USB_N: U4.21(DMU) USB-B1.2(D-)
USB_P: U4.22(DPU) USB-B1.3(D+)
V_USB: C52.1 J1.1 USB-B1.1(VBUS)
VBUS2: C30.1 C43.1 F1.2 U4.44(CSB2) USB-A1.1(VBUS)
VDD25OUT: C38.2 C39.2 C40.2 C46.2 C47.2 C48.2 R11.2 U4.1(VDD25OUT) U4.12(VDD25) U4.24(VDD25) U4.33(VDD25)
VREF: F2.1 JTAG1.1
WP_A: R45.2 RN3.2 U6.3(WP_(IO2))
NetC29_2: C29.2 R1.1 Y1.1(OSC1) Y1.4(NC)
NetC31_2: C31.2 C32.2 C33.2 C34.2 C35.2 R8.1 U4.9(VDD33) U4.20(VDD33) U4.30(VDD33) U4.48(VDD33REG)
NetC36_1: C36.1 R6.1 U4.10(X1) Y2.2(OSC2)
NetC37_1: C37.1 R6.2 R7.2 Y2.1(OSC1)
NetC41_1: C41.1 C42.1 R13.1 R14.2 U4.16(AVSS(R)) U4.18(AVSS)
NetC41_2: C41.2 C42.2 R11.1 U4.17(AVDD) U4.19(AVDD)
NetC45_2: C45.2 R16.2 U4.37(SYSRSTB)
NetC53_2: C53.2 C67.2 R23.2 U5.19(VCC)
NetC54_2: C54.2 C68.2 R24.2 U5.1(VCCIO)
NetC57_1: C57.1 R27.2 R29.2 R30.1
NetC60_1: C60.1 R42.2 R44.2 R46.1
NetC65_1: C65.1 R57.2 R60.2 R61.1
NetD1_1: D1.1(A) FAN3.3 R25.2 R27.1
NetD2_1: D2.1(A) FAN2.3 R38.2 R42.1
NetD3_1: D3.1(A) FAN1.3 R50.2 R57.1
NetDONE_2: DONE.2(K) R55.1
NetFAN1_4: FAN1.4 R53.1 R58.1
NetFAN2_4: FAN2.4 R41.1 R43.1
NetFAN3_4: FAN3.4 R26.1 R28.1
NetJ2_2: J2.2 R66.1
NetJTAG1_3: JTAG1.3 RN2.5
NetJTAG1_4: JTAG1.4 RN2.6
NetJTAG1_5: JTAG1.5 RN2.7
NetJTAG1_6: JTAG1.6 RN2.8
NetLED1_1: LED1.1(A) RN1.4
NetLED2_1: LED2.1(A) RN1.3
NetLED3_1: LED3.1(A) RN1.2
NetLED4_1: LED4.1(A) RN1.1
NetP1_4: P1.4 R62.1
NetP1_5: P1.5 R63.1
NetP1_6: P1.6 R64.1
NetQ1_1: Q1.1(B) R9.2
NetQ2_1: Q2.1(B) R21.2
NetR2_2: R2.2 Y1.3(OSC2)
NetR4_1: R4.1 USB-B1.5(SHLD) USB-B1.6(SHLD)
NetR5_1: R5.1 USB-A1.5(SHLD) USB-A1.6(SHLD)
NetR7_1: R7.1 U4.11(X2)
NetR14_1: R14.1 U4.15(RREF)
NetR18_1: R18.1 U4.45(PPB1)
NetR19_1: R19.1 U4.46(CSB1)
NetR20_1: R20.1 U4.43(PPB2)
NetR35_2: R35.2 U5.24(AGND)
NetU4_7: U4.7(AMBER) U4.8(GREEN)

Not connected (* = marked no-connect by the designer): MASK1 1; MASK2 1; TPM1 0(MASKTEST); TPM2 0(MASKTEST); U1 L11(CMPCS_B_2)*; U5 5(NC) 12(NC) 13(NC) 23(NC) 25(NC) 27(OSCI) 28(OSCO) 29(NC)

## Layout directives
differential pair: D1_N, D1_P, D2_N, D2_P, USB_N, USB_P

## Notes on the sheet
- LED&SW
- FPGA
- CLOCK
- Power  Decoupling
- Connect
- LDO
- ATX Power Control
- FPGA Config
- USB HUB
- TEMP Sensor
- FT232 UART
- Holes & Marks
- Hash Unit
- FAN Control
- 1      1
- ngzhang
- 1.5
- (in symbol XC6SLX16-2FTG256C, part A) BANK 0
- (in symbol XC6SLX16-2FTG256C, part B) BANK 1
- (in symbol XC6SLX16-2FTG256C, part C) BANK 2
- (in symbol XC6SLX16-2FTG256C, part D) BANK 3

## Library data of the parts
C1-C13 C15-C25 C27-C42 C45-C48 C50-C70 = Cap Semi: Capacitor (Semiconductor SIM Model); Published: 8-Jun-2000; LatestRevisionDate: 29-May-2009; LatestRevisionNote: IPC-7351 Footprint Added.; PackageReference: C1206; Publisher: Altium Limited; PackageDescription: Chip Capacitor
  C1-C13 C28-C33 C35 C40 C41 C46-C48 C53-C55 C59 C61 C62 C64 C69 C70: Value: 0.47uF
  C15 C27 C38 C50 C56 C58 C63: Value: 22uF
  C16-C25 C34 C39 C42 C45 C51 C52 C66-C68: Value: 4.7uF
  C36 C37 C57 C60 C65: Value: 22pF
C14 C26 = T492C: Solid Tantalum Chip Capacitor, T492 Series - CWR11 Style Per Mil-PRF-55365/8; Published: 17-Jul-2002; LatestRevisionDate: 19-Mar-2004; LatestRevisionNote: Silkscreen dimensions re-sized.; DatasheetDocument: Mar-2001; PackageDocument: Mar-2001; PackageReference: C; Publisher: Altium Limited; Code_JEITA: 6032-28; ComponentLink1Description: Manufacturer Link; ComponentLink1URL: http://www.kemet.com/; ComponentLink2Description: Datasheet; ComponentLink2URL: http://www.kemet.com/kemet/web/homepage/kechome.nsf/vapubfilesname/F3102TA.pdf/$file/F3102TA.pdf; Value: 100uF/6.3V
C43 C44 C49 = Cap Pol1: Polarized Capacitor (Radial); Published: 8-Jun-2000; LatestRevisionDate: 17-Jul-2002; LatestRevisionNote: Re-released for DXP Platform.; PackageReference: RB7.6-15; Publisher: Altium Limited; PackageDescription: Polarized Capacitor (Radial); 2 Leads
  C43 C44: Value: 470uF/6.3V
  C49: Value: 270uF/16V
D1-D3 = Diode 1N4148: High Conductance Fast Diode; Published: 8-Jun-2000; LatestRevisionDate: 17-Jul-2002; LatestRevisionNote: Re-released for DXP Platform.; DatasheetVersion: 1997; PackageReference: DO-35; Publisher: Altium Limited; PackageDescription: Diode, Axial; Body 3.8 x 1.9 mm (LxDia. max), Lead Dia. 0.53 mm (max); Code_JEDEC: DO-204-AH; ComponentLink1Description: Manufacturer Link; ComponentLink1URL: http://www.fairchildsemi.com/; ComponentLink2Description: Datasheet; ComponentLink2URL: http://www.fairchildsemi.com/ds/1N%2F1N4148.pdf
DATA_P1-DATA_P4 = Header 20X2: Header, 20-Pin, Dual row; LatestRevisionDate: 17-Jul-2002; LatestRevisionNote: Re-released for DXP Platform.; Publisher: Altium Limited
DONE LED1-LED4 = LED3: Typical BLUE SiC LED; Published: 8-Jun-2000; LatestRevisionDate: 17-Dec-2003; LatestRevisionNote: PCB Footprint replaced.; DatasheetVersion: 16-Apr-2002; PackageVersion: 16-Apr-2002; PackageReference: 3.5X2.8X1.9; Publisher: Altium Limited; PackageDescription: SM LED; 2 C-Bend Leads; Body 3.5 x 2.8 x 1.9 mm, inc leads (LxWxH typ)
F1 F2 = Fuse 2: Fuse; Published: 8-Jun-2000; LatestRevisionDate: 17-Jul-2002; LatestRevisionNote: Re-released for DXP Platform.; PackageReference: PIN-W2/E2.8; Publisher: Altium Limited
FAN1-FAN3 = Header 4: Header, 4-Pin; LatestRevisionDate: 17-Jul-2002; LatestRevisionNote: Re-released for DXP Platform.; Publisher: Altium Limited
FB1-FB4 R1-R66 = Res3: Resistor; Published: 8-Jun-2000; LatestRevisionDate: 29-May-2009; LatestRevisionNote: IPC-7351 Footprint Added.; PackageReference: J1-0603; Publisher: Altium Limited; PackageDescription: Chip Resistor
  FB1-FB4 R1 R4 R5 R8 R11 R13 R23 R24 R35: Value: MB
  R2 R7: Value: 0R
  R3 R15 R16 R19 R27 R31 R42 R57: Value: 10K
  R6: Value: 1M
  R9 R21: Value: 1K
  R10 R22 R55 R62-R64 R66: Value: 270R
  R12 R17 R25 R26 R30 R32 R37-R41 R46 R50-R54 R59 R61 R65: Value: 4.7K
  R14: Value: 2.43K
  R18 R20 R48: Value: 510R
  R28 R29 R36 R43 R44 R49 R56 R58 R60: Value: 100R
  R33 R34: Value: NC
  R45 R47: Value: 1.8K
J1 J2 = Header 2: Header, 2-Pin; LatestRevisionDate: 17-Jul-2002; LatestRevisionNote: Re-released for DXP Platform.; Publisher: Altium Limited
JTAG1 P1 P2 = Header 6: Header, 6-Pin; LatestRevisionDate: 17-Jul-2002; LatestRevisionNote: Re-released for DXP Platform.; Publisher: Altium Limited
M1-M4 = M_Hole
MASK1 MASK2 = Socket: pin to pad: 1>0; LatestRevisionDate: 17-Jul-2002; LatestRevisionNote: Re-released for DXP Platform.; Publisher: Altium Limited
P3 P4 = Header 3: Header, 3-Pin; LatestRevisionDate: 17-Jul-2002; LatestRevisionNote: Re-released for DXP Platform.; Publisher: Altium Limited
POWER_IN1 = Header 5X2A: Header, 5-Pin, Dual row; LatestRevisionDate: 17-Jul-2002; LatestRevisionNote: Re-released for DXP Platform.; Publisher: Altium Limited
PROG = SW-PB: Switch; Published: 24-Mar-1999; LatestRevisionDate: 17-Jul-2002; LatestRevisionNote: Re-released for DXP Platform.; PackageReference: SPST-2; Publisher: Altium Limited; PackageDescription: Switch; 2 Leads
Q1 Q2 = MMBT3904: NPN Switching Transistor; Published: 17-Sep-2003; LatestRevisionDate: 12-Dec-2006; LatestRevisionNote: IPC-7351 Footprint Added.; DatasheetVersion: 13-May-2002; PackageVersion: May-1999; PackageReference: SOT23; Publisher: Altium Limited; PackageDescription: 3-Pin SOT-23 Package 0.95 mm Pitch, 2.3 mm Lead Span; ComponentLink1Description: Manufacturer Link; ComponentLink1URL: http://www.semiconductors.philips.com/; ComponentLink2Description: Datasheet; ComponentLink2URL: http://www.semiconductors.philips.com/acrobat/datasheets/MMBT3904_4.pdf
RN1-RN3 = RES4PACK
U1 = XC6SLX16-2FTG256C: Spartan-6 LX 1.2V FPGA, 186 User I/Os, 256-Ball Fine-Pitch Thin BGA (1.0mm Pitch), Speed Grade 2, Commercial Grade, Pb-Free; Published: 17-Nov-2009; DatasheetVersion: ver1.6, Nov-2010; PackageVersion: ver1.3, Oct-2007; PackageReference: FTG256; Publisher: Altium Limited; PackageDescription: 256-Ball Fine Pitch Thin Ball Grid Array 1.00 mm Pitch (FTG256) - Pb-Free; Code_JEDEC: MS-034-AAF-1*; ComponentLink1Description: Manufacturer Link; ComponentLink1URL: http://www.xilinx.com; ComponentLink2Description: Spartan-6 Datasheet; ComponentLink2URL: http://www.xilinx.com/support/documentation/data_sheets/ds160.pdf; ComponentLink3Description: Spartan-6 Documents; ComponentLink3URL: http://www.xilinx.com/support/documentation/spartan-6.htm; ComponentLink4Description: Xilinx.com Home; ComponentLink4URL: http://www.xilinx.com
U2 = LM1086CS-2.5: 1.5A Low Dropout Positive Regulators, 3-pin TO-263; Manufacturer: National Semiconductor; PackageTopMarking: NSUZXYTTE#*LM1086*CS-2.5; PowerWise: N; CompType: LDO IC; Published: 4-Dec-2008; DatasheetVersion: Jun-2005; PackageVersion: revF, Apr-2005; PackageReference: TS3B; Publisher: Altium Limited; PackageDescription: TO-263, Molded, .400 x .390 x .180in, 3 Lead, .1in Pitch, Surface Mount; Supplier 1: Farnell; Supplier Part Number 1: 7614068; PartNumber: LM1086CS-2.5; RoHS: N; PinCount: 3; Code_JEDEC: MO-169-AA; ComponentLink1Description: LM1086 Datasheet; ComponentLink1URL: http://www.national.com/ds/LM/LM1086.pdf; ComponentLink2Description: LM1086 Web Page; ComponentLink2URL: http://www.national.com/pf/LM/LM1086.html; ComponentLink3Description: TS3B Package Page; ComponentLink3URL: http://www.national.com/packaging/folders/ts3b.html
U4 = uPD720114
U5 = FT232RQ-Tray: USB UART Asynchronous Serial Data Transfer Chip, QFN-32, Tray; Published: 19-Aug-2010; DatasheetVersion: ver 2.07, Jul-2010; PackageVersion: 2010; PackageReference: PQFN5X5-32; Publisher: Altium Limited; PackageDescription: 32-Pin Quad Flat No-Lead 0.5 mm Pitch, Pullback, 3.2 x 3.2 mm Exposed Pad; ComponentLink1Description: Manufacturer Link; ComponentLink1URL: http://www.ftdichip.com/Products/ICs/FT232R.htm; ComponentLink2Description: Datasheet; ComponentLink2URL: http://www.ftdichip.com/Support/Documents/DataSheets/ICs/DS_FT232R.pdf
U6 = W25Q64CV
USB-A1 = 1364428-1: USB 1.1, Vertical, Thru-Hole, A Type, Receptacle, 4 Position, Black; ContactMaterial: Copper Alloy; ContactPlating: Gold (30); TerminationLength: 2.79mm [0.110in.]; PCB_Layout: Complies with manufacturer's recommendation.; DrillSize: Corresponds to nominal value.; PanelGround: Without; Published: 15-Jul-2004; DatasheetDocument: 05-Jan-2004; PackageDocument: 05-Jan-2004; PackageReference: 1364428; Publisher: Altium Limited; HousingMaterial: Glass-Filled Thermoplastic; ComponentLink1Description: Manufacturer Link; ComponentLink1URL: http://www.tycoelectronics.com/; ComponentLink2Description: Packaging Specification; ComponentLink2URL: http://ecommas.tycoelectronics.com/commerce/DocumentDelivery/DDEController?Action=showdoc&DocId=Customer+Drawing%7F1364428%7FB%7Ftif%7FEnglish%7FENG_CD_1364428_B.tif
USB-B1 = 1470156-1: USB 1.1, Right Angle, Thru-Hole, B Type, Receptacle, 4 Position, White; ContactMaterial: Phosphor Bronze; ContactPlating: Gold over Nickel; TerminationLength: 3.00mm [0.118in.]; PCB_Layout: Complies with manufacturer's recommendation.; DrillSize: Corresponds to nominal value.; PanelGround: Without; Published: 15-Jul-2004; DatasheetDocument: 02-Jun-2001; PackageDocument: 02-Jun-2001; PackageReference: 1470156; Publisher: Altium Limited; HousingMaterial: Glass-Filled Thermoplastic; ComponentLink1Description: Manufacturer Link; ComponentLink1URL: http://www.tycoelectronics.com/; ComponentLink2Description: Packaging Specification; ComponentLink2URL: http://ecommas.tycoelectronics.com/commerce/DocumentDelivery/DDEController?Action=showdoc&DocId=Customer+Drawing%7F1470156%7FO%7Ftif%7FEnglish%7FC_1470156_O.tif
Y1 = 2SMX: Surface Mount Quartz Crystal; Note: PCB layout complies with manufacturer's recommendation.; Published: 17-Jul-2002; DatasheetDocument: 9-Sep-1999; PackageDocument: 9-Sep-1999; PackageReference: 2SMX; Publisher: Altium Limited; ComponentLink1Description: Manufacturer Link; ComponentLink1URL: http://www.cmac.com/mt/
Y2 = XTAL: Crystal Oscillator; Published: 8-Jun-2000; LatestRevisionDate: 17-Jul-2002; LatestRevisionNote: Re-released for DXP Platform.; PackageReference: R38; Publisher: Altium Limited; PackageDescription: Crystal, Thru-Hole; 2 Leads; Body 3.1 x 8.2 mm (Dia.xH)